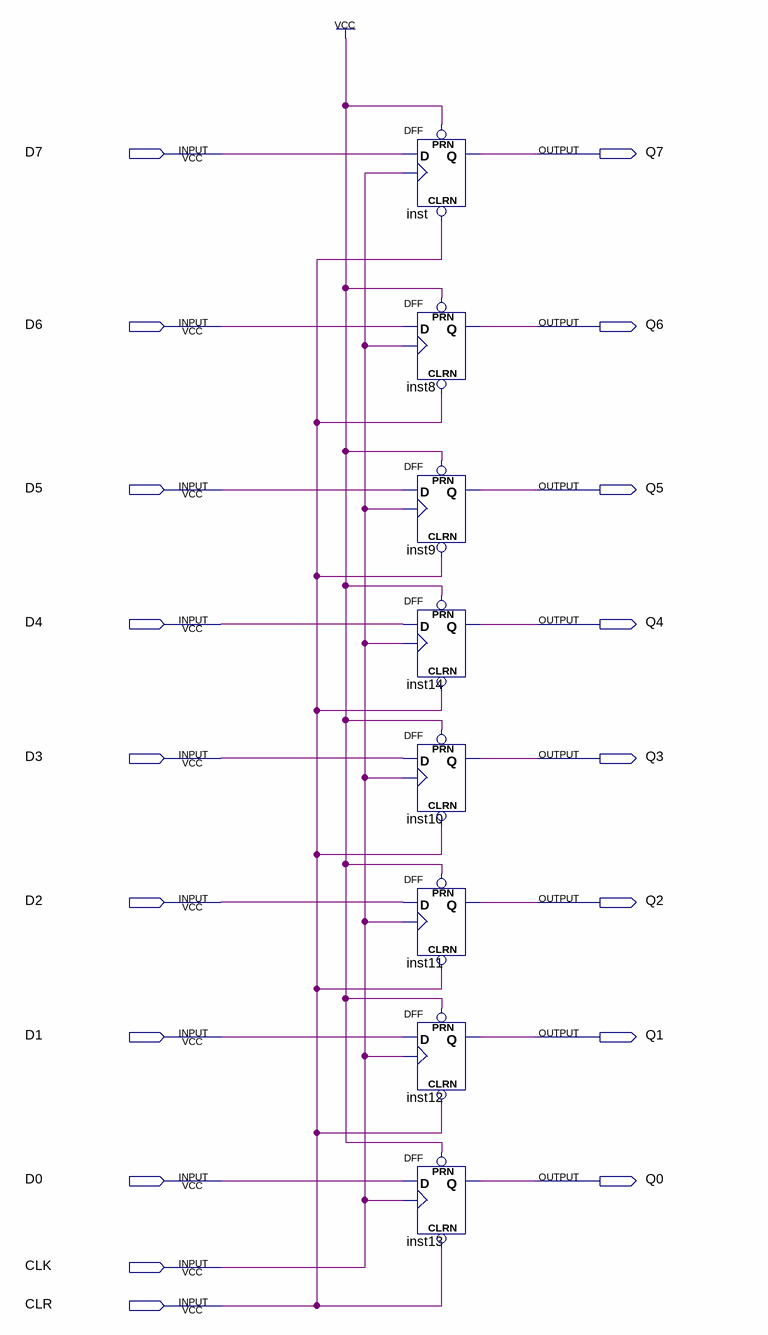
[diagram p0: schematic sheet]
// Quartus schematic register8.bdf as structural Verilog: 8 symbols, 18 pins
module register8 (
  input  D7,
  input  D6,
  input  D5,
  input  D4,
  input  D3,
  input  D2,
  input  D1,
  input  D0,
  input  CLK,
  input  CLR,
  output Q7,
  output Q6,
  output Q5,
  output Q4,
  output Q3,
  output Q2,
  output Q1,
  output Q0
);

  DFF inst (.CLRN(CLR), .CLK(CLK), .D(D7), .PRN(1'b1), .Q(Q7));
  DFF inst8 (.CLRN(CLR), .CLK(CLK), .D(D6), .PRN(1'b1), .Q(Q6));
  DFF inst9 (.CLRN(CLR), .CLK(CLK), .D(D5), .PRN(1'b1), .Q(Q5));
  DFF inst14 (.CLRN(CLR), .CLK(CLK), .D(D4), .PRN(1'b1), .Q(Q4));
  DFF inst10 (.CLRN(CLR), .CLK(CLK), .D(D3), .PRN(1'b1), .Q(Q3));
  DFF inst11 (.CLRN(CLR), .CLK(CLK), .D(D2), .PRN(1'b1), .Q(Q2));
  DFF inst12 (.CLRN(CLR), .CLK(CLK), .D(D1), .PRN(1'b1), .Q(Q1));
  DFF inst13 (.CLRN(CLR), .CLK(CLK), .D(D0), .PRN(1'b1), .Q(Q0));
endmodule
